# Altium schematic sheet 3 - Sense2GoL_V1.2_Debugger.SchDoc
size A3; Doc_ConfidentialStatus: <Doc_ConfidentialStatus>; Doc_Preliminary: <Doc_Preliminary>; Release: <Rel.>; Copyright: © Infineon Technologies AG 2014. All Rights Reserved.; DVS_Title: <DVS_Title>; DVS_Author: <DVS_Author>; DVS_ApprovedBy: <DVS_Appr>; DVS_Revision: <DVS_Rev.>; DVS_Release: <DVS_Rel.>; DVS_Configuration: <DVS_Configuration>; PageSetup: Record=PageOptions|CenterHorizontal=True|CenterVertical=True|PrintScale=1.01|XCorrection=1.00|YCorrection=1.00|PrintKind=0|BorderSize=5000000|LeftOffset=0|BottomOffset=0|Orientation=2|PaperLength=1000|PaperWidth=1000|Scale=100|PaperSource=7|PrintQuality=-4|MediaType=1|DitherType=10|PaperKind=A3|PrintScaleMode=1
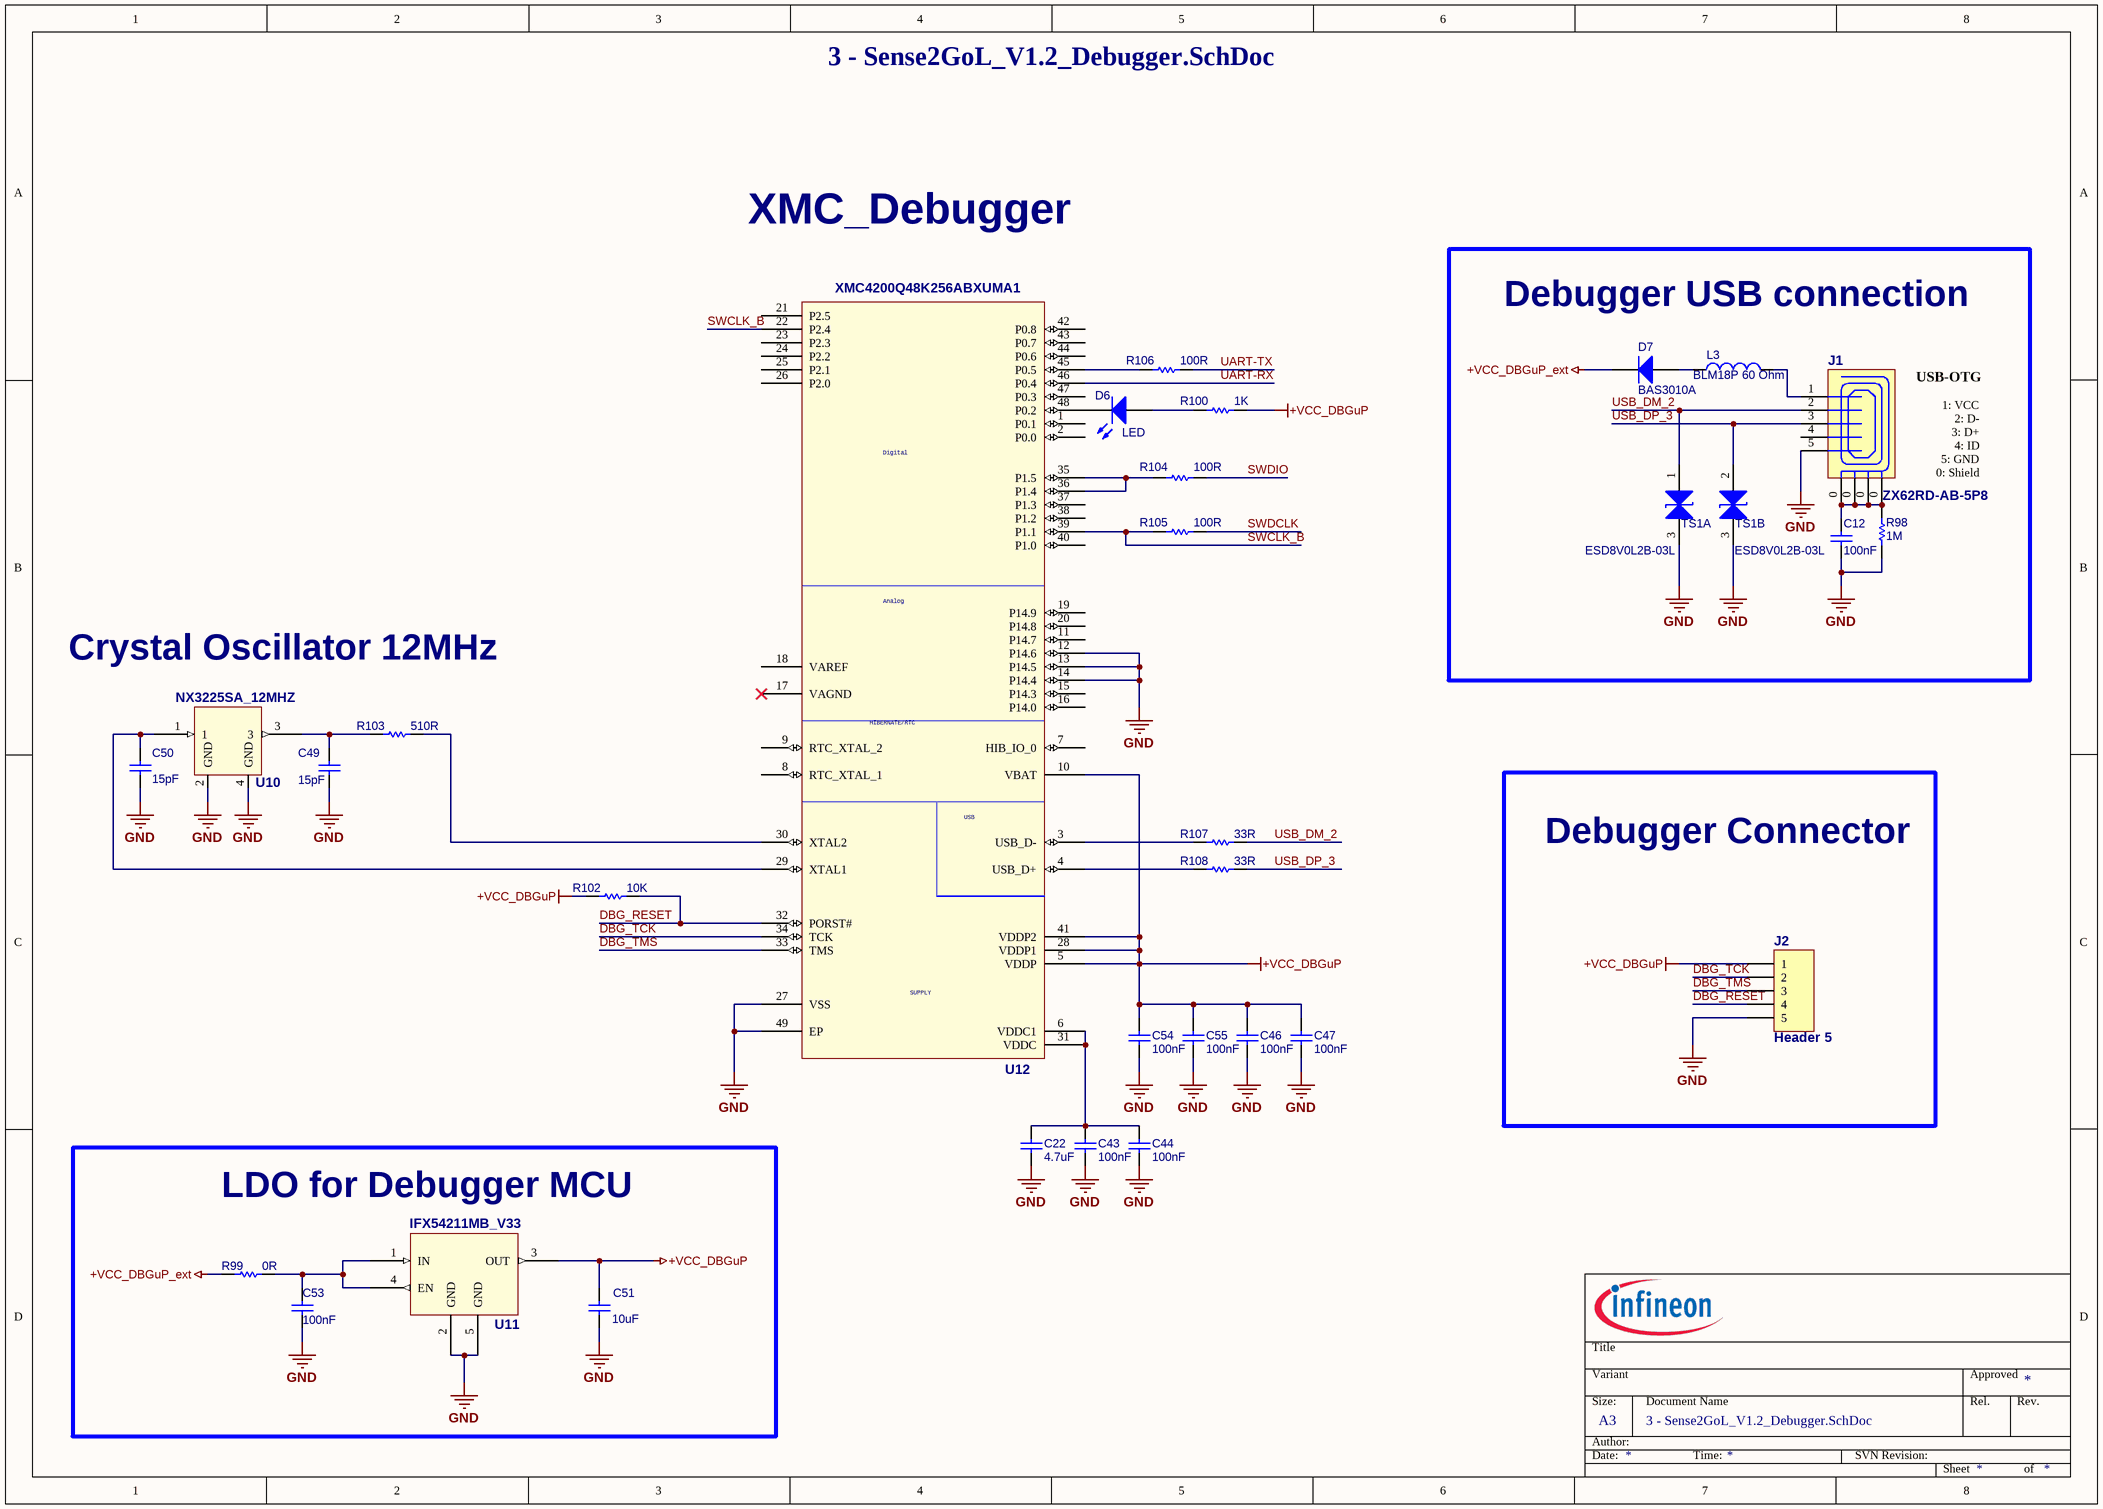
[diagram p0: 3 - Sense2GoL_V1.2_Debugger.SchDoc]

## Parts
C12  value 100nF  [0402_DURAC]  (hidden comment: Cap)
C22  value 4.7uF  [0402_DURAC]  (hidden comment: Cap)
C43  value 100nF  [0402_DURAC]  (hidden comment: Cap)
C44  value 100nF  [0402_DURAC]  (hidden comment: Cap)
C46  value 100nF  [0402_DURAC]  (hidden comment: Cap)
C47  value 100nF  [0402_DURAC]  (hidden comment: Cap)
C49  value 15pF  [0402_DURAC]  (hidden comment: Cap)
C50  value 15pF  [0402_DURAC]  (hidden comment: Cap)
C51  value 10uF  [0402_DURAC]  (hidden comment: Cap)
C53  value 100nF  [0402_DURAC]  (hidden comment: Cap)
C54  value 100nF  [0402_DURAC]  (hidden comment: Cap)
C55  value 100nF  [0402_DURAC]  (hidden comment: Cap)
D6  LED  [LED_0201]
D7  BAS3010A  [SOD323]
J1  ZX62RD-AB-5P8  [MICRO_AB_ZX62]
J2  Header 5  [CON_5PIN_254P]
L3  BLM18P 60 Ohm  [L_0603]
R98  value 1M  [0402_R]  (hidden comment: Res1)
R99  value 0R  [0402_R]  (hidden comment: Res1)
R100  value 1K  [R_0201]  (hidden comment: Res1)
R102  value 10K  [0402_R]  (hidden comment: Res1)
R103  value 510R  [0402_R]  (hidden comment: Res1)
R104  value 100R  [0402_R]  (hidden comment: Res1)
R105  value 100R  [0402_R]  (hidden comment: Res1)
R106  value 100R  [0402_R]  (hidden comment: Res1)
R107  value 33R  [0402_R]  (hidden comment: Res1)
R108  value 33R  [0402_R]  (hidden comment: Res1)
TS1  ESD8V0L2B-03L  [ESD8VOL2B]  (parts A,B of 2)
U10  NX3225SA_12MHZ  [NX3225SA]
U11  IFX54211MB_V33  [inf-pg-sct595v]
U12  XMC4200Q48K256ABXUMA1  [inf-pg-vqfn-48-_-5200x5200tp_n]

## Blocks framed on the sheet
Debugger USB connection: C12 D7 J1 L3 R98 TS1
Debugger Connector: J2
LDO for Debugger MCU: C51 C53 R99 U11

## Nets
+VCC_DBGuP: C46.2 C47.2 C51.2 C54.2 C55.2 J2.1 R100.1 R102.1 U11.3(OUT) U12.5(VDDP) U12.10(VBAT) U12.28(VDDP1) U12.41(VDDP2)
+VCC_DBGuP_ext: D7.2(K) R99.2
GND: C12.2 C22.2 C43.1 C44.1 C46.1 C47.1 C49.2 C50.2 C51.1 C53.2 C54.1 C55.1 J1.5(GND) J2.5 R98.1 TS1.3 U10.2(GND) U10.4(GND) U11.2(GND) U11.5(GND) U12.12(P14.6) U12.13(P14.5) U12.14(P14.4) U12.27(VSS) U12.49(EP)
DBG_RESET: J2.4 R102.2 U12.32(PORST#)
DBG_TCK: J2.2 U12.34(TCK)
DBG_TMS: J2.3 U12.33(TMS)
SWCLK_B: R105.1 U12.22(P2.4) U12.39(P1.1)
SWDCLK: R105.2
SWDIO: R104.2
UART-RX: U12.46(P0.4)
UART-TX: R106.2
USB_DM_2: J1.2(D-) R107.2 TS1.1
USB_DP_3: J1.3(D+) R108.2 TS1.2
NetC12_1: C12.1 J1.0(Shield) R98.2
NetC22_1: C22.1 C43.2 C44.2 U12.6(VDDC1) U12.31(VDDC)
NetC49_1: C49.1 R103.1 U10.3
NetC50_1: C50.1 U10.1 U12.29(XTAL1)
NetC53_1: C53.1 R99.1 U11.1(IN) U11.4(EN)
NetD6_1: D6.1(A) R100.2
NetD6_2: D6.2(K) U12.48(P0.2)
NetD7_1: D7.1(A) L3.1
NetJ1_1: J1.1(VCC) L3.2
NetR103_2: R103.2 U12.30(XTAL2)
NetR104_1: R104.1 U12.35(P1.5) U12.36(P1.4)
NetR106_1: R106.1 U12.45(P0.5)
NetR107_1: R107.1 U12.3(USB_D-)
NetR108_1: R108.1 U12.4(USB_D+)

Not connected (* = marked no-connect by the designer): J1 4(ID); U12 1(P0.1) 2(P0.0) 7(HIB_IO_0) 8(RTC_XTAL_1) 9(RTC_XTAL_2) 11(P14.7) 15(P14.3) 16(P14.0) 17(VAGND)* 18(VAREF) 19(P14.9) 20(P14.8) 21(P2.5) 23(P2.3) 24(P2.2) 25(P2.1) 26(P2.0) 37(P1.3) 38(P1.2) 40(P1.0) 42(P0.8) 43(P0.7) 44(P0.6) 47(P0.3)

## Notes on the sheet
- XMC_Debugger
- Crystal Oscillator 12MHz
- Title
- Variant
- Approved
- Date:
- Author:
- Size:
- A3
- Document Name
- Time:
- SVN Revision:
- Rel.
- Rev.
- Sheet
- of
- (in symbol USB Micro AB) USB-OTG; 1: VCC; 2: D-; 3: D+; 4: ID; 5: GND; 0: Shield
- (in symbol XMC4200_VQFN48) Digital; Analog; HIBERNATE/RTC; USB; SUPPLY

## Library data of the parts
C12 C22 C43 C44 C46 C47 C49-C51 C53-C55 = Cap: Capacitor; Published: 8-Jun-2000; LatestRevisionDate: 17-Jul-2002; LatestRevisionNote: Re-released for DXP Platform.; PackageReference: RAD-0.3; Publisher: Altium Limited
D6 = LED: Typical INFRARED GaAs LED; Published: 8-Jun-2000; LatestRevisionDate: 08-Jul-2005; LatestRevisionNote: Mech Layer 1 removed.; PackageReference: LED-0; Publisher: Altium Limited
D7 = Diode: Default Diode; Published: 8-Jun-2000; LatestRevisionDate: 17-Jul-2002; LatestRevisionNote: Re-released for DXP Platform.; PackageDocument: Sep-1996; PackageReference: SMC; Publisher: Altium Limited; Code_JEDEC: DO-214-AB
J1 = USB Micro AB: Hersteller: Hirose; Preis: 1.59; FootprintBOM: SMD; Kleinmengendistributor: Digi-Key; KleinmengendistributorBestellnummer: H11611CT-ND
J2 = Header 5: Header, 5-Pin; LatestRevisionDate: 17-Jul-2002; LatestRevisionNote: Re-released for DXP Platform.; Publisher: Altium Limited
L3 = Ferrite Bead
R98-R100 R102-R108 = Res1: Resistor; Published: 8-Jun-2000; LatestRevisionDate: 17-Jul-2002; LatestRevisionNote: Re-released for DXP Platform.; PackageReference: AXIAL-0.3; Publisher: Altium Limited
TS1 = Diode dual: TVS Diode dual; Hersteller: Infineon; Preis: 0.56; FootprintBOM: TSLP-3-1; Kleinmengendistributor: Digi-Key; KleinmengendistributorBestellnummer: ESD8V0L2B-03LE6327INCT-ND
U10 = NX3225SA_12MHZ: NX3225SA-12.000M-STD-CRS-2; code_DK: 644-1128-2-ND
U11 = IFX54211MB_V33: code_DK: NN; code_MO: 726-IFX54211MBV33HTM
U12 = XMC4200_VQFN48: code_DK: XMC4200Q48K256ABXUMA1CT-ND